# Altium schematic sheet Sheet2.SchDoc: Sample Sheet Title
size B; Date: MM/DD/YYYY; Author: Sample Author; Organization: ORGANIZATION; Address1: ADDRESS 1; Address2: ADDRESS 2; Address3: ADDRESS 3; Address4: ADDRESS 4; Revision: -; SheetNumber: 1; SheetTotal: 1; ENG_APP_DATE: --/--/--; DSN_APP_DATE: --/--/--; CHK_APP_DATE: --/--/--
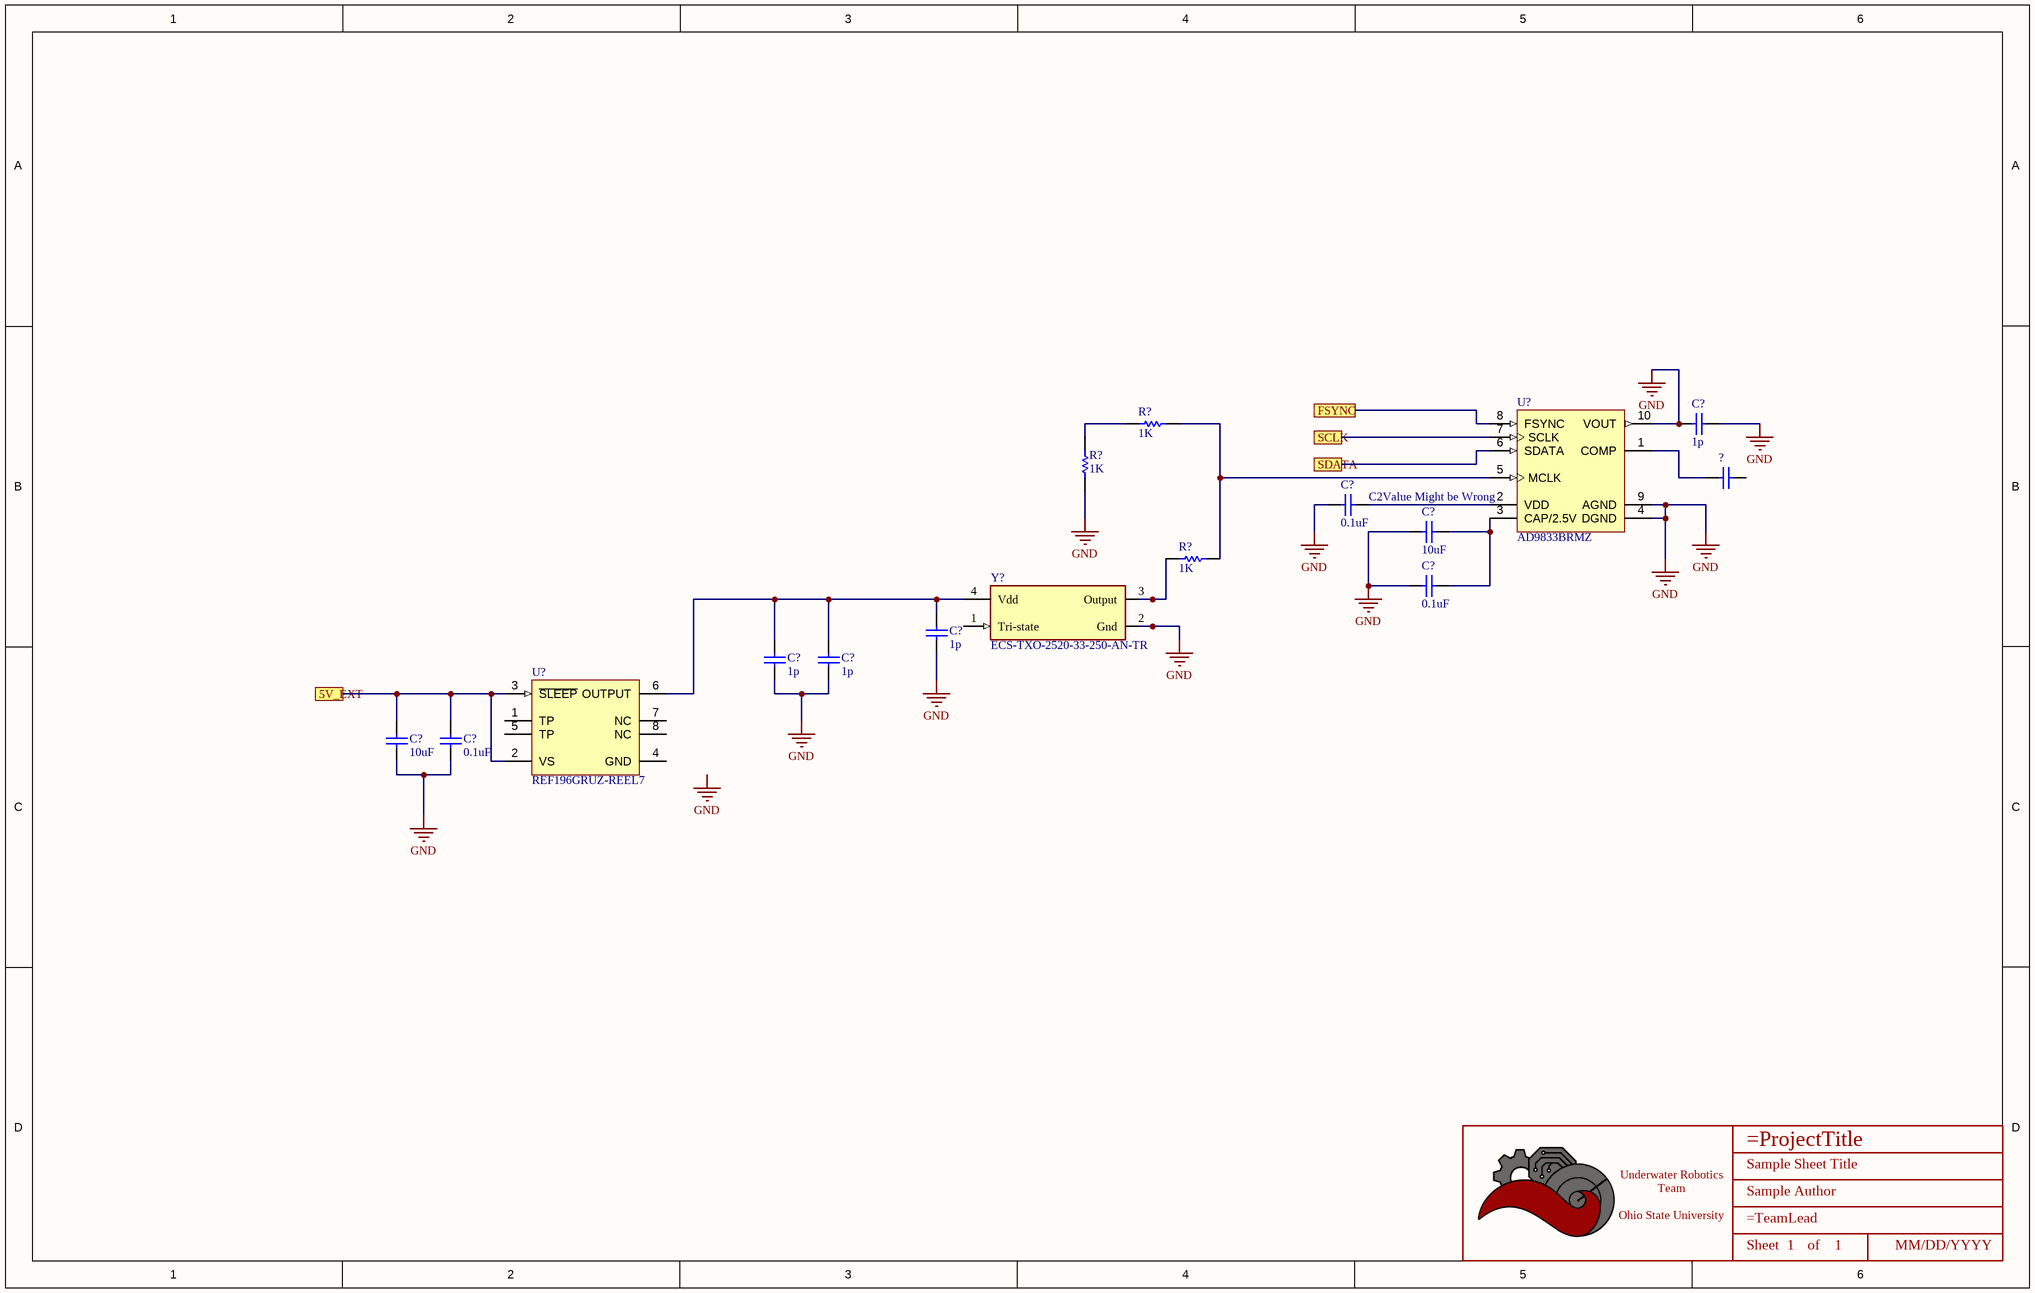
[diagram p0: Sheet2.SchDoc]

## Parts
(Parts that share a designator on the sheet are numbered #1, #2 ... from top to bottom, then left to right.)
*  Title_Block  [LOGO]  (value not drawn)  (graphical)
?  Capacitor  (value not drawn)
C?#1  value 1p  (hidden comment: Capacitor)
C?#2  value 0.1uF  (hidden comment: Capacitor)
C?#3  value 10uF  (hidden comment: Capacitor)
C?#4  value 0.1uF  (hidden comment: Capacitor)
C?#5  value 1p  (hidden comment: Capacitor)
C?#6  value 1p  (hidden comment: Capacitor)
C?#7  value 1p  (hidden comment: Capacitor)
C?#8  value 10uF  (hidden comment: Capacitor)
C?#9  value 0.1uF  (hidden comment: Capacitor)
R?#1  value 1K  (hidden comment: Resistor)
R?#2  value 1K  (hidden comment: Resistor)
R?#3  value 1K  (hidden comment: Resistor)
U?#1  AD9833BRMZ  [ADI-RM-10_M]
U?#2  REF196GRUZ-REEL7  [ADI-RU-8_N]
Y?  ECS-TXO-2520-33-250-AN-TR  [FP-ECS-TXO-2520-MFG]

## Ports
5V_EXT, FSYNC, SCLK, SDATA

## Nets
GND: C?#1.1 C?#1.2 C?#2.1 C?#3.1 C?#4.1 C?#5.1 C?#6.1 C?#7.1 C?#8.1 C?#9.1 R?#2.1 U?#1.4(DGND) U?#1.9(AGND) U?#1.10(VOUT) Y?.2(Gnd)
5V_EXT: C?#8.2 C?#9.2 U?#2.2(VS) U?#2.3(~{SLEEP}) ; port 5V_EXT
FSYNC: U?#1.8(FSYNC) ; port FSYNC
SCLK: U?#1.7(SCLK) ; port SCLK
SDATA: U?#1.6(SDATA) ; port SDATA
Net?_1: ?.1 U?#1.1(COMP)
NetC?#2_2: C?#2.2 U?#1.2(VDD)
NetC?#3_2: C?#3.2 C?#4.2 U?#1.3(CAP/2.5V)
NetC?#5_2: C?#5.2 C?#6.2 C?#7.2 U?#2.6(OUTPUT) Y?.4(Vdd)
NetR?#1_1: R?#1.1 R?#2.2
NetR?#1_2: R?#1.2 R?#3.2 U?#1.5(MCLK)
NetR?#3_1: R?#3.1 Y?.3(Output)

Not connected (* = marked no-connect by the designer): ? 2; U?#2 1(TP) 4(GND) 5(TP) 7(NC) 8(NC); Y? 1(Tri-state)

## Notes on the sheet
- C2Value Might be Wrong
- Labels drawn without touching a wire or pin: GND
- DWG. NO.
- REV.
- SHT.
- THIS DOCUMENT AND THE DATA DISCLOSED HEREIN OR HEREWITH IS THE PROPERTY OF ALTIUM LIMITED AND MAY BE FREELY DISTRIBUTED IN WHOLE. NO RIGHTS ARE RESERVED OR EXPRESS OR IMPLIED WARANTEE GIVEN.
- REVISION
- DESCRIPTION
- DATE
- APPROVED
- ENG:
- APPROVALS
- PROJECT
- DSN:
- CHK:
- REFERENCE DOCUMENTS
- PROJECT REVISION:
- TITLE
- DOCUMENT REVISION:
- DESIGN ITEM:
- BOM:
- FAB DWG:
- PCB DWG:
- ASSY DWG:
- SCALE:
- SIZE
- B
- CAGE CODE
- FILE NAME
- DWG NO.
- SHEET
- OF
- REV
- (in symbol Title_Block) Underwater Robotics Team / Ohio State University; Sheet; of

## Library data of the parts
* = Title_Block: UWRT Schematic Title Block Template / Created June 2021, Dylan Trainor
? = Capacitor: SimulationGenericComponent: True; Value: 0.1u
C?#1-C?#9 = Capacitor: SimulationGenericComponent: True
R?#1-R?#3 = Resistor: TC1: 0; SimulationGenericComponent: True; TC2: 0
U?#1 = CMP-0293-00077-1: Low Power, 12.65 mW, 2.3 V to 5.5 V, Programmable Waveform Generator, 10-Bit, Serial, RM-10, 50 Tube, Pb-Free; Resolution (Bits): 10bit; Compliance Range (V): 650mV; FS Iout (mA nom): 3mA; REFCLK Multiplier: No; Master fclk: 25MHz; I Supply total (max): 5.5mA; Tuning Word Width (bits): 28bit; Code_JEDEC: MO-187-BA; DatasheetVersion: Rev. D; PackageVersion: 5/8/2005; ComponentLink1URL: www.analog.com; ComponentLink3Description: Package Specification; PackageDescription: 10-Lead Mini Small Outline Package [MSOP]; I/O Interface: Serial; ComponentLink2Description: Datasheet; ComponentLink1Description: Manufacturer URL; PackageReference: RM-10; ComponentLink2URL: http://www.analog.com/static/imported-files/data_sheets/AD9833.pdf; ComponentLink3URL: http://www.analog.com/static/imported-files/packages/PKG_PDF/MSOP%28RM%29/RM_10.pdf
U?#2 = CMP-0784-00468-1: Precision Micropower, Low Dropout Voltage Reference, 3.3 V Output, 3.4 to 15 V Supply, Industrial, 8-pin SOP (RU-8), Reel; Manufacturer: Analog Devices; Vout: 3.3V; Ref Out TC (ppm/C): 10; PackageVersion: Jan-03; Packing: Reel; PackageDescription: 8-Pin Thin Shrink Small Outline Package, Body 3 x 4.4 mm, Pitch 0.65 mm; ComponentLink2URL: http://www.analog.com/static/imported-files/data_sheets/REF19xSeries.pdf; Mounting Technology: Surface Mount; ComponentLink1URL: http://www.analog.com/en/index.html; Code_JEDEC: MO-153AA; Operating Temp Range: -40 to 85 degC; ComponentLink4URL: Product URL:http://www.analog.com/en/special-linear-functions/voltage-references/ref196/products/product.html; PackageReference: RU-8; ComponentLink3Description: Package Specification; ComponentLink4Description: URL Link1; ComponentLink3URL: http://www.analog.com/static/imported-files/packages/359224089841708504863856053953356548880RU08.pdf; DatasheetVersion: Rev. L; ComponentLink2Description: Datasheet; ComponentLink1Description: Manufacturer URL; PartNumber: REF196GRUZ-REEL7
Y? = CMP-40224-000034-1: XTAL OSC TCXO 25.0000MHZ HCMOS; RoHS Compliant: Yes